# Altium schematic sheet UI_mon.SchDoc
size A4; DocumentNumber: 28; SheetNumber: 28; SheetTotal: 30
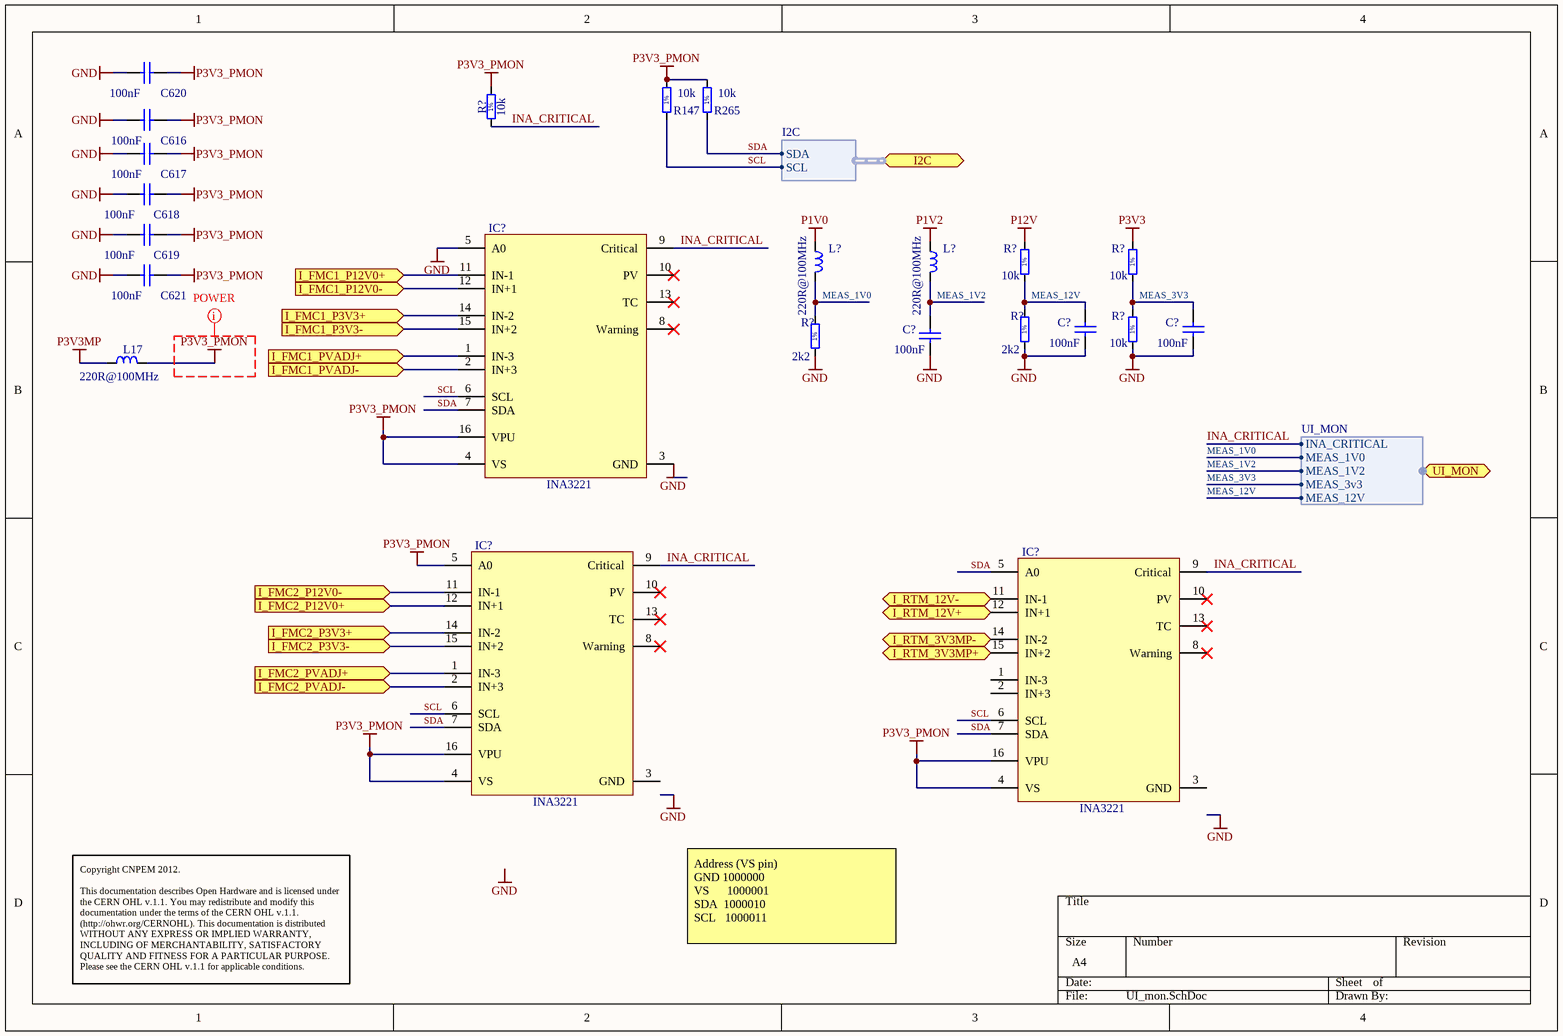
[diagram p0: UI_mon.SchDoc]

## Parts
(Parts that share a designator on the sheet are numbered #1, #2 ... from top to bottom, then left to right.)
C616  100nF  [CAPC0603X33N]
C617  100nF  [CAPC0603X33N]
C618  100nF  [CAPC0603X33N]
C619  100nF  [CAPC0603X33N]
C620  100nF  [CAPC0603X33N]
C621  100nF  [CAPC0603X33N]
C?#1  100nF  [CAPC0603X33N]
C?#2  100nF  [CAPC0603X33N]
C?#3  100nF  [CAPC0603X33N]
IC?#1  INA3221  [PQFN65P400X400X150-17N-S243]
IC?#2  INA3221  [PQFN65P400X400X150-17N-S243]
IC?#3  INA3221  [PQFN65P400X400X150-17N-S243]
L17  220R@100MHz  [INDC2012X105N]
L?#1  220R@100MHz  [INDC2012X105N]
L?#2  220R@100MHz  [INDC2012X105N]
R147  10k  [RESC1005X40N]
R265  10k  [RESC1005X40N]
R?#1  10k  [RESC1608X55N]
R?#2  10k  [RESC1005X40N]
R?#3  10k  [RESC1005X40N]
R?#4  2k2  [RESC1005X40N]
R?#5  10k  [RESC1005X40N]
R?#6  2k2  [RESC1005X40N]

## Ports
I2C (harness I2C), I_FMC1_P3V3+ (in), I_FMC1_P3V3- (in), I_FMC1_P12V0+ (in), I_FMC1_P12V0- (in), I_FMC1_PVADJ+ (in), I_FMC1_PVADJ- (in), I_FMC2_P3V3+ (in), I_FMC2_P3V3- (in), I_FMC2_P12V0+ (in), I_FMC2_P12V0- (in), I_FMC2_PVADJ+ (in), I_FMC2_PVADJ- (in), I_RTM_3V3MP+ (in), I_RTM_3V3MP- (in), I_RTM_12V+ (in), I_RTM_12V- (in), UI_MON (harness UI_MON)

## Harnesses
I2C: SCL, SDA
UI_MON: INA_CRITICAL, MEAS_1V0, MEAS_12V, MEAS_1V2, MEAS_3v3

## Nets
GND: C616.2 C617.2 C618.2 C619.2 C620.2 C621.2 C?#1.1 C?#2.1 C?#3.1 IC?#1.3(GND) IC?#1.5(A0) R?#4.1 R?#5.1 R?#6.1
P1V0: L?#1.1
P1V2: L?#2.1
P3V3: R?#3.2
P3V3_PMON: C616.1 C617.1 C618.1 C619.1 C620.1 C621.1 IC?#1.4(VS) IC?#1.16(VPU) IC?#2.4(VS) IC?#2.5(A0) IC?#2.16(VPU) IC?#3.4(VS) IC?#3.16(VPU) L17.2 R147.2 R265.2 R?#1.2
P3V3MP: L17.1
P12V: R?#2.2
I_FMC1_P3V3+: IC?#1.14(IN-2) ; port I_FMC1_P3V3+
I_FMC1_P3V3-: IC?#1.15(IN+2) ; port I_FMC1_P3V3-
I_FMC1_P12V0+: IC?#1.11(IN-1) ; port I_FMC1_P12V0+
I_FMC1_P12V0-: IC?#1.12(IN+1) ; port I_FMC1_P12V0-
I_FMC1_PVADJ+: IC?#1.1(IN-3) ; port I_FMC1_PVADJ+
I_FMC1_PVADJ-: IC?#1.2(IN+3) ; port I_FMC1_PVADJ-
I_FMC2_P3V3+: IC?#2.14(IN-2) ; port I_FMC2_P3V3+
I_FMC2_P3V3-: IC?#2.15(IN+2) ; port I_FMC2_P3V3-
I_FMC2_P12V0+: IC?#2.12(IN+1) ; port I_FMC2_P12V0+
I_FMC2_P12V0-: IC?#2.11(IN-1) ; port I_FMC2_P12V0-
I_FMC2_PVADJ+: IC?#2.1(IN-3) ; port I_FMC2_PVADJ+
I_FMC2_PVADJ-: IC?#2.2(IN+3) ; port I_FMC2_PVADJ-
I_RTM_3V3MP+: IC?#3.15(IN+2) ; port I_RTM_3V3MP+
I_RTM_3V3MP-: IC?#3.14(IN-2) ; port I_RTM_3V3MP-
I_RTM_12V+: IC?#3.12(IN+1) ; port I_RTM_12V+
I_RTM_12V-: IC?#3.11(IN-1) ; port I_RTM_12V-
INA_CRITICAL: IC?#1.9(Critical) IC?#2.9(Critical) IC?#3.9(Critical) R?#1.1 ; port UI_MON.INA_CRITICAL
MEAS_1V0: L?#1.2 R?#6.2 ; port UI_MON.MEAS_1V0
MEAS_1V2: C?#3.2 L?#2.2 ; port UI_MON.MEAS_1V2
MEAS_3V3: C?#2.2 R?#3.1 R?#5.2 ; port UI_MON.MEAS_3v3
MEAS_12V: C?#1.2 R?#2.1 R?#4.2 ; port UI_MON.MEAS_12V
SCL: IC?#1.6(SCL) IC?#2.6(SCL) IC?#3.6(SCL) R147.1 ; port I2C.SCL
SDA: IC?#1.7(SDA) IC?#2.7(SDA) IC?#3.5(A0) IC?#3.7(SDA) R265.1 ; port I2C.SDA

Not connected (* = marked no-connect by the designer): IC?#1 8(Warning)* 10(PV)* 13(TC)*; IC?#2 3(GND) 8(Warning)* 10(PV)* 13(TC)*; IC?#3 1(IN-3) 2(IN+3) 3(GND) 8(Warning)* 10(PV)* 13(TC)*

## Layout directives
net class POWER: P3V3_PMON

## Notes on the sheet
- Copyright CNPEM 2012.
  This documentation describes Open Hardware and is licensed under the CERN OHL v.1.1. You may redistribute and modify this documentation under the terms of the CERN OHL v.1.1. (http://ohwr.org/CERNOHL). This documentation is distributed WITHOUT ANY EXPRESS OR IMPLIED WARRANTY, INCLUDING OF MERCHANTABILITY, SATISFACTORY QUALITY AND FITNESS FOR A PARTICULAR PURPOSE. Please see the CERN OHL v.1.1 for applicable conditions.
- Address (VS pin)
  GND 1000000
  VS      1000001
  SDA  1000010
  SCL   1000011
- Labels drawn without touching a wire or pin: GND
- (in symbol R0402_2K2_1%_0.0625W_100PPM) 1%
- (in symbol R0402_10K_1%_0.0625W_100PPM) 1%
- (in symbol R0603_10K_1%_0.1W_100PPM) 1%

## Library data of the parts
C616-C621 C?#1-C?#3 = CC0201_100NF_6.3V_10%_X5R: Non-polarised capacitor; Part Description: SMD Multilayer Chip Ceramic Capacitor; Manufacturer: GENERIC; Manufacturer1 Part Number: 02016D104KAT2A; Voltage: 6.3V; TC: X5R; Tolerance: ±10%; Table: Capacitors SMD; Part Number: CC0201_100NF_6.3V_10%_X5R; Component Kind: Standard; Component Type: Standard; Pin Count: 2; Value: 100nF; Status: Not Recommended; Manufacturer Part Number: CC0201_100NF_6.3V_10%_X5R; Case: 0201; Mounted: Yes; Socket: No; SMD: Yes; Manufacturer1 Example: AVX; Manufacturer1 ComponentHeight: 0.33mm; HelpURL: \\cern.ch\dfs\Applications\Altium\Datasheets\CC0201_X5R_AVX.pdf; Author: CERN DEM JLC; CreateDate: 2007-12-03; LatestRevisionDate: 2007-12-03
IC?#1-IC?#3 = INA3221: Triple-Channel, High-Side Measurement, Shunt and Bus Voltage Monitor  with I  2C™ Interface
L17 = IND0805_MURATA_BLM21PG221SN1D: Inductor; Part Description: SMD EMIFIL Suppression Chip Bead Ferrite; Manufacturer: MURATA; Power: 2A; Resistance: 0.05R; Tolerance: ±25%; Table: Inductors SMD; Part Number: IND0805_MURATA_BLM21PG221SN1D; Component Kind: Standard; Component Type: Standard; Pin Count: 2; Value: 220R@100MHz; Status: None; Manufacturer Part Number: BLM21PG221SN1D; Case: 0805; Mounted: Yes; Socket: No; SMD: Yes; ComponentHeight: 1.05mm; HelpURL: \\cern.ch\dfs\Applications\Altium\Datasheets\IND0402_MURATA_BLM21P.pdf; Author: CERN DEM JLC; CreateDate: 25/01/2010; LatestRevisionDate: 25/01/2010
L?#1 L?#2 = IND0805_MURATA_BLM21PG221SN1D: Inductor; Part Description: SMD EMIFIL Suppression Chip Ferrite Bead; Manufacturer: MURATA; Power: 2A; Resistance: 0.05R; Tolerance: ±25%; Table: Inductors SMD; Part Number: IND0805_MURATA_BLM21PG221SN1D; Component Kind: Standard; Component Type: Standard; Pin Count: 2; Value: 220R@100MHz; Status: None; Manufacturer Part Number: BLM21PG221SN1D; Case: 0805; Mounted: Yes; Socket: No; SMD: Yes; ComponentHeight: 1.05mm; HelpURL: \\cern.ch\dfs\Applications\Altium\Datasheets\IND0402_MURATA_BLM21P.pdf; Author: CERN DEM JLC; CreateDate: 2010-01-25; LatestRevisionDate: 2010-01-25
R147 R265 R?#2 R?#3 R?#5 = R0402_10K_1%_0.0625W_100PPM: Resistor - 1%; Part Description: General Purpose Thick Film Chip Resistor; Manufacturer: GENERIC; Manufacturer1 Part Number: 232270671003L; TC: ±100ppm/°C; Table: Resistors SMD; Part Number: R0402_10K_1%_0.0625W_100PPM; Component Kind: Standard; Component Type: Standard; Pin Count: 2; Value: 10k; Status: Not recommended; Power: 0.0625W; Tolerance: ±1%; Manufacturer Part Number: R0402_10K_1%_0.0625W_100PPM; Case: 0402; Mounted: Yes; Socket: No; SMD: Yes; Manufacturer1 Example: YAGEO PHYCOMP; Manufacturer1 ComponentHeight: 0.4mm; HelpURL: \\cern.ch\dfs\Applications\Altium\Datasheets\R0402_Phycomp_RC0402.pdf; Author: CERN DEM JLC; CreateDate: 2007-12-03; LatestRevisionDate: 2012-10-17
R?#1 = R0603_10K_1%_0.1W_100PPM: Resistor - 1%; Part Description: General Purpose Thick Film Chip Resistor; Manufacturer: GENERIC; Manufacturer1 Part Number: NRC06F1002TRF; Power: 0.1W; TC: ±100ppm/°C; Part Number: R0603_10K_1%_0.1W_100PPM; Component Kind: Standard; Component Type: Standard; Pin Count: 2; Value: 10k; Status: Preferred; Tolerance: ±1%; Manufacturer Part Number: R0603_10K_1%_0.1W_100PPM; Case: 0603; Mounted: Yes; Sense: No; Socket: No; SMD: Yes; Manufacturer1 Example: NIC COMPONENT; Manufacturer1 ComponentHeight: 0.55mm; HelpURL: \\cern.ch\dfs\Applications\Altium\Datasheets\R0603_NIC_NRC.pdf; Author: CERN DEM JLC; CreateDate: 03/12/2007; LatestRevisionDate: 13/03/2008
R?#4 R?#6 = R0402_2K2_1%_0.0625W_100PPM: Resistor - 1%; Part Description: General Purpose Thick Film Chip Resistor; Manufacturer: GENERIC; Manufacturer1 Part Number: 232270672202L; TC: ±100ppm/°C; Table: Resistors SMD; Part Number: R0402_2K2_1%_0.0625W_100PPM; Component Kind: Standard; Component Type: Standard; Pin Count: 2; Value: 2k2; Status: Not recommended; Power: 0.0625W; Tolerance: ±1%; Manufacturer Part Number: R0402_2K2_1%_0.0625W_100PPM; Case: 0402; Mounted: Yes; Socket: No; SMD: Yes; Manufacturer1 Example: YAGEO PHYCOMP; Manufacturer1 ComponentHeight: 0.4mm; HelpURL: \\cern.ch\dfs\Applications\Altium\Datasheets\R0402_Phycomp_RC0402.pdf; Author: CERN DEM JLC; CreateDate: 2007-12-03; LatestRevisionDate: 2012-10-17